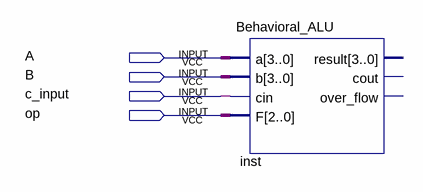
[diagram p0: schematic sheet]
// Quartus schematic symbol_behaviorl.bdf as structural Verilog: 1 symbols, 4 pins
module symbol_behaviorl (
  input  A,
  input  B,
  input  c_input,
  input  op
);

  wire [2:0] undriven_3;
  wire [3:0] undriven, undriven_2;

  Behavioral_ALU inst (.a(undriven), .b(undriven_2), .cin(c_input), .F(undriven_3));  // open: result, cout, over_flow
endmodule
